# EAGLE design 7ch_op_amp_board_v40 (EAGLE 7.2.0)
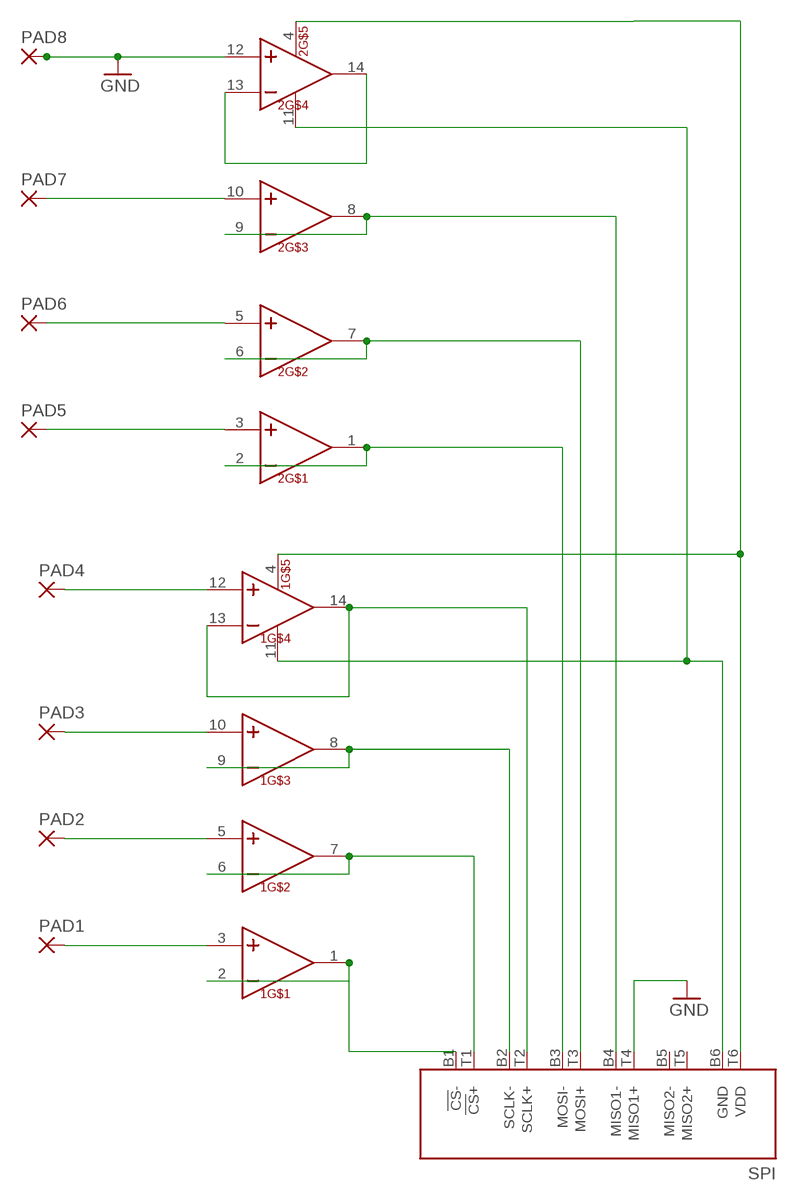
[diagram p0: schematic, sheet 1]

## Parts
1  TL074-TSSOP  [TSSOP14]
2  TL074-TSSOP  [TSSOP14]
PAD1  1,6/0,8  [1,6/0,8]
PAD2  1,6/0,8  [1,6/0,8]
PAD3  1,6/0,8  [1,6/0,8]
PAD4  1,6/0,8  [1,6/0,8]
PAD5  1,6/0,8  [1,6/0,8]
PAD6  1,6/0,8  [1,6/0,8]
PAD7  1,6/0,8  [1,6/0,8]
PAD8  1,6/0,8  [1,6/0,8]
SPI  RHD2000-CABLE-AMP-SIDE  [OMNETICS_PZN-12-AA]

## Nets
GND: 2.12(IN+) PAD8.1(P) SPI.T4(MISO1+)
N$1: 1.1(OUT) 1.2(IN-) SPI.B1(!CS!-)
N$2: 1.6(IN-) 1.7(OUT) SPI.T1(!CS!+)
N$3: 2.1(OUT) 2.2(IN-) SPI.B3(MOSI-)
N$4: 2.6(IN-) 2.7(OUT) SPI.T3(MOSI+)
N$5: 2.8(OUT) 2.9(IN-) SPI.B4(MISO1-)
N$6: 2.13(IN-) 2.14(OUT)
N$7: 1.13(IN-) 1.14(OUT) SPI.T2(SCLK+)
N$8: 1.3(IN+) PAD1.1(P)
N$9: 1.8(OUT) 1.9(IN-) SPI.B2(SCLK-)
N$11: 1.5(IN+) PAD2.1(P)
N$12: 1.10(IN+) PAD3.1(P)
N$13: 1.12(IN+) PAD4.1(P)
N$21: 2.10(IN+) PAD7.1(P)
N$22: 2.5(IN+) PAD6.1(P)
N$23: 2.3(IN+) PAD5.1(P)
V+: 1.4(VCC+) 2.4(VCC+) SPI.T6(VDD)
V-: 1.11(VCC-) 2.11(VCC-) SPI.B6(GND)
Unconnected: SPI.B5(MISO2-) SPI.T5(MISO2+)

## Library data of the parts
1 2 = kjbrown:TL074-TSSOP
PAD1-PAD8 = wirepad:1,6/0,8: THROUGH-HOLE PAD
SPI = RHD2000:RHD2000-CABLE-AMP-SIDE

## Board
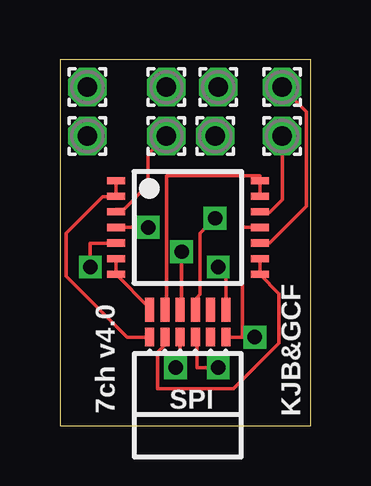
[diagram p1: board, top side]
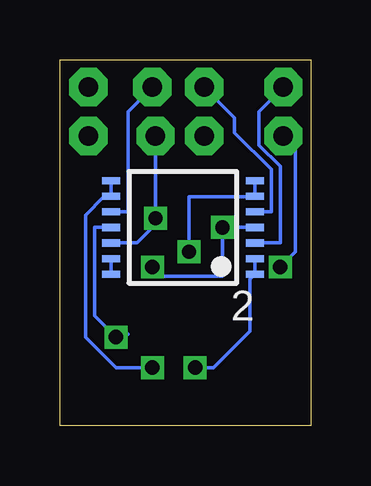
[diagram p2: board, bottom side, seen from below]

Size 10.46 x 15.23 mm. Coordinates in mm from the lower left corner, seen from the top.
Outline: 0,0 10.46,0 10.46,15.23 0,15.23 0,0
Copper layers (1*16): Top 0.0356mm / dielectric 1.5011mm / Bottom 0.0356mm
Design rules "LaenPCBOrder": minimum track width 6mil, minimum drill 13mil, track to track 6mil, track to pad 6mil, pad to pad 6mil, via to via 6mil, smd to smd 6mil, copper to edge 15mil, drill to drill 6mil, minimum pad ring 7mil, minimum via ring 7mil, stop-mask expansion 3mil, vias tented up to drill 0mil, thermal gap 10mil

### Footprints (pad centres in the part's own frame; a part is rotated, then mirrored left to right if it is on the bottom)
TSSOP14 = smd 0.3 x 0.75: 1 -1.95,-3; 2 -1.3,-3; 3 -0.65,-3; 4 0,-3; 5 0.65,-3; 6 1.3,-3; 7 1.95,-3; 8 1.95,3; 9 1.3,3; 10 0.65,3; 11 0,3; 12 -0.65,3; 13 -1.3,3; 14 -1.95,3
1,6/0,8 = drill 0.813 pad 1.6 octagon: 1 0,0
OMNETICS_PZN-12-AA = smd 0.381 x 0.762: B1 1.587,-1.016; B2 0.953,-1.016; B3 0.318,-1.016; B4 -0.318,-1.016; B5 -0.953,-1.016; B6 -1.587,-1.016 | smd 0.381 x 1.016: T1 1.587,-2.159; T2 0.953,-2.159; T3 0.318,-2.159; T4 -0.318,-2.159; T5 -0.953,-2.159; T6 -1.587,-2.159

### Placement (x,y rotation side)
1  5.33,8.25 270 top
2  5.33,8.25 90 bottom
PAD1  4.45,12.06 0 top
PAD2  1.14,12.06 0 top
PAD3  9.27,14.1 0 top
PAD4  9.27,12.06 0 top
PAD5  1.14,14.1 0 top
PAD6  4.45,14.1 0 top
PAD7  6.6,14.1 0 top
PAD8  6.48,12.06 0 top
SPI  5.33,2.67 180 top

### Tracks (layer width: path | path; a pad name or v marks a point on that pad's centre or on a via)
GND  (via drill 0.6)
  Top 0.152: SPI.T4 5.71,4.83 5.71,5.33 5.84,5.46 5.84,8 v6.48,8.64
  Bottom 0.152: PAD8.1 v6.48,8.64 6.48,8.38 7.24,7.62 8.32,7.62 2.12 8.33,7.62
N$1
  Top 0.152: 1.2 1.1 | 2.33,9.53 1.2 | SPI.B1 2.79,3.68 0.25,6.22 0.25,8 1.78,9.53 2.3,9.53 1.2
N$2
  Top 0.152: 1.6 1.7 3.75,4.89 SPI.T1
N$3  (via drill 0.6)
  Top 0.152: SPI.B3 5.02,2.6 v4.83,2.41
  Bottom 0.152: 2.2 2.1 2.54,6.1 2.54,3.94 4.06,2.41 v4.83,2.41
N$4  (via drill 0.6)
  Top 0.152: SPI.T3 5.08,4.83 v5.08,7.24
  Bottom 0.152: 2.7 2.6 | 2.33,9.65 2.6 | v5.08,7.24 5.08,9.53 2.36,9.53 2.6
N$5  (via drill 0.6)
  Top 0.152: 5.59,3.68 SPI.B4 5.71,3.68 5.71,2.41 v6.6,2.41
  Bottom 0.152: 2.8 2.9 8.33,9.53 8.64,9.53 9.4,8.76 9.4,3.68 8.13,2.41 v6.6,2.41
N$6
  Bottom 0.152: 2.14 2.13
N$7
  Top 0.152: SPI.T2 4.45,4.83 4.45,10.41 8.33,10.41 1.14 1.13 8.33,9.53
N$8
  Top 0.152: 1.3 2.33,9.02 2.67,9.02 3.68,10.03 3.68,11.3 PAD1.1
N$9
  Top 0.152: 1.9 1.8 9.14,5.49 9.14,3.43 7.24,1.52 4.06,1.52 4.06,3.05 | SPI.B2 4.38,3.37 4.19,3.17 4.06,3.05 | 4.06,2.92 4,2.98 4.06,3.05
N$10  (via drill 0.6)
  other vias: 4.83,2.41
N$11  (via drill 0.6)
  Top 0.152: 1.5 1.27,7.61 v1.27,6.6
  Bottom 0.152: PAD2.1 0.64,11.56 0.64,7.24 v1.27,6.6
N$12
  Top 0.152: 1.10 8.33,7.62 8.76,7.62 10.29,9.14 10.29,13.08 PAD3.1
N$13
  Top 0.152: 1.12 8.33,8.89 8.76,8.89 9.27,9.4 PAD4.1
N$15  (via drill 0.6)
  other vias: 3.68,8.25
N$16  (via drill 0.6)
  other vias: 6.6,6.6
N$21
  Bottom 0.152: 2.10 7.62,8.9 7.62,13.08 PAD7.1
N$22
  Bottom 0.152: 2.5 1.65,8.9 1.65,10.67 3.17,12.19 3.17,12.83 PAD6.1
N$23
  Bottom 0.152: 2.3 2.33,7.62 1.27,7.62 1.27,10.79 2.16,11.68 2.16,13.08 PAD5.1
N$24  (via drill 0.6)
  other vias: 8.13,3.68
V+  (via drill 0.6)
  Top 0.152: 2.4 v3.68,8.25 | v6.6,6.6 6.92,6.6 SPI.T6
  Bottom 0.152: 2.4 v3.68,8.25 3.68,6.22 6.1,6.22 6.48,6.6 v6.6,6.6
V-
  Top 0.152: SPI.B6 7.62,3.68 | 7.62,3.68 8.13,3.68 | 2.11 7.62,8.25 7.62,3.68
  Bottom 0.152: 2.11 9.02,8.25 9.02,4.57 8.51,4.06 | 8.51,4.06 8.13,3.68 8,3.81 7.62,3.81 7.87,4.06 8.51,4.06

### Text on the board
_tsilk: 7ch v4.0 | SPI | KJB&GCF